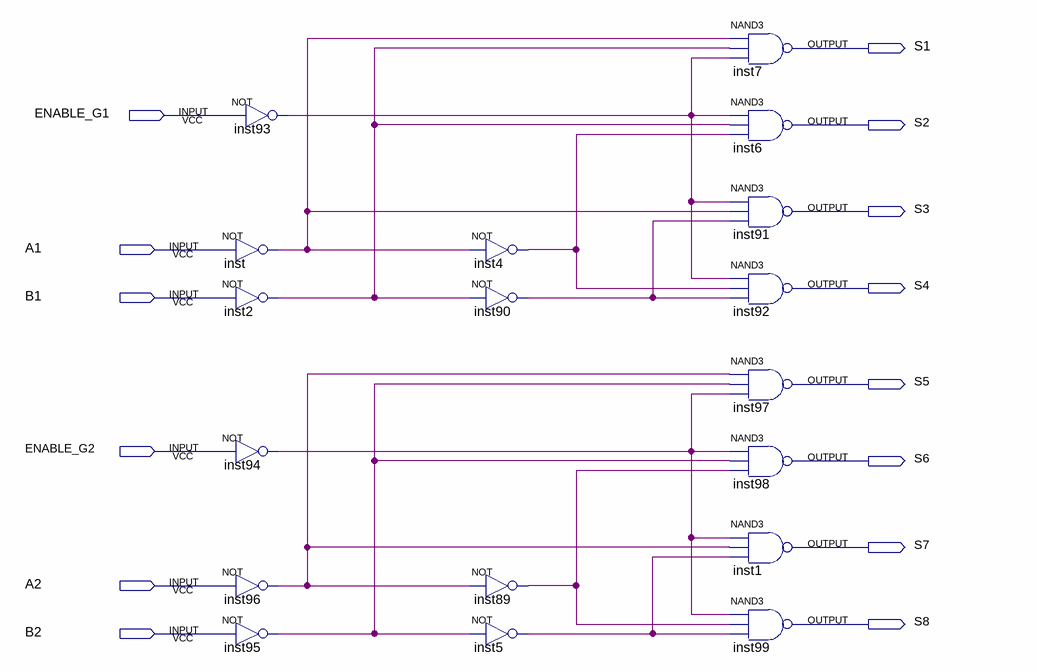
[diagram p0: schematic sheet]
// Quartus schematic CI74LS138_DEMUX.bdf as structural Verilog: 18 symbols, 14 pins
module CI74LS138_DEMUX (
  input  ENABLE_G1,
  input  A1,
  input  B1,
  input  ENABLE_G2,
  input  A2,
  input  B2,
  output S1,
  output S2,
  output S3,
  output S4,
  output S5,
  output S6,
  output S7,
  output S8
);

  wire inst2_out, inst4_out, inst5_out, inst89_out, inst90_out, inst93_out, inst94_out, inst95_out,
       inst96_out, inst_out;

  not inst93 (inst93_out, ENABLE_G1);
  not inst (inst_out, A1);
  not inst2 (inst2_out, B1);
  not inst94 (inst94_out, ENABLE_G2);
  not inst96 (inst96_out, A2);
  not inst95 (inst95_out, B2);
  not inst4 (inst4_out, inst_out);
  not inst90 (inst90_out, inst2_out);
  not inst89 (inst89_out, inst96_out);
  not inst5 (inst5_out, inst95_out);
  nand inst7 (S1, inst_out, inst2_out, inst93_out);
  nand inst6 (S2, inst93_out, inst2_out, inst4_out);
  nand inst91 (S3, inst93_out, inst_out, inst90_out);
  nand inst92 (S4, inst93_out, inst4_out, inst90_out);
  nand inst97 (S5, inst96_out, inst95_out, inst94_out);
  nand inst98 (S6, inst94_out, inst95_out, inst89_out);
  nand inst1 (S7, inst94_out, inst96_out, inst5_out);
  nand inst99 (S8, inst94_out, inst89_out, inst5_out);
endmodule
